# Altium schematic sheet P1.schdoc
size 420 x 297 mm; Symbol: Sheet-Symbol_A3; Company: 嘉立创EDA; Version: V1.0; Page Size: A3; @Project Name: ATX主板机械布局; @Page Count: 1; @Update Date: 2024-10-10; @Create Date: 2024-10-11; @Schematic Name: Schematic1; @Page No: 1; @Page Name: P1; Device: Sheet-Symbol_A3; Border: 1; Title Block Position: 3; Width: 1655; Height: 1170; Region Start: 1; X Region Count: 6; Y Region Count: 4; Blade Width: 10; @Create Time: 04:16:34; @Update Time: 16:16:34
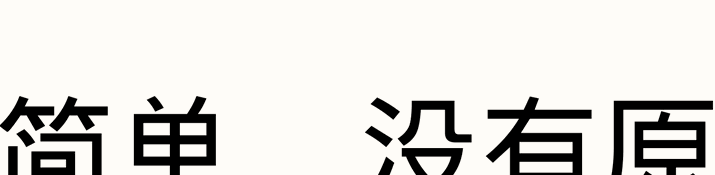
[diagram p0: P1.schdoc]

## Notes on the sheet
- 过于简单，没有原理图
- 更新日期
- 2024-10-10
- 原理图
- 图页
- Schematic1
- P1
- 创建日期
- 物料编码
- 2024-10-11
- 审阅
- 绘制
- ATX主板机械布局
- 版本
- V1.0
- 尺寸
- A3
- 页
- 1
- 嘉立创EDA
- 共